# Altium schematic sheet module_wifi.SchDoc
size Tabloid
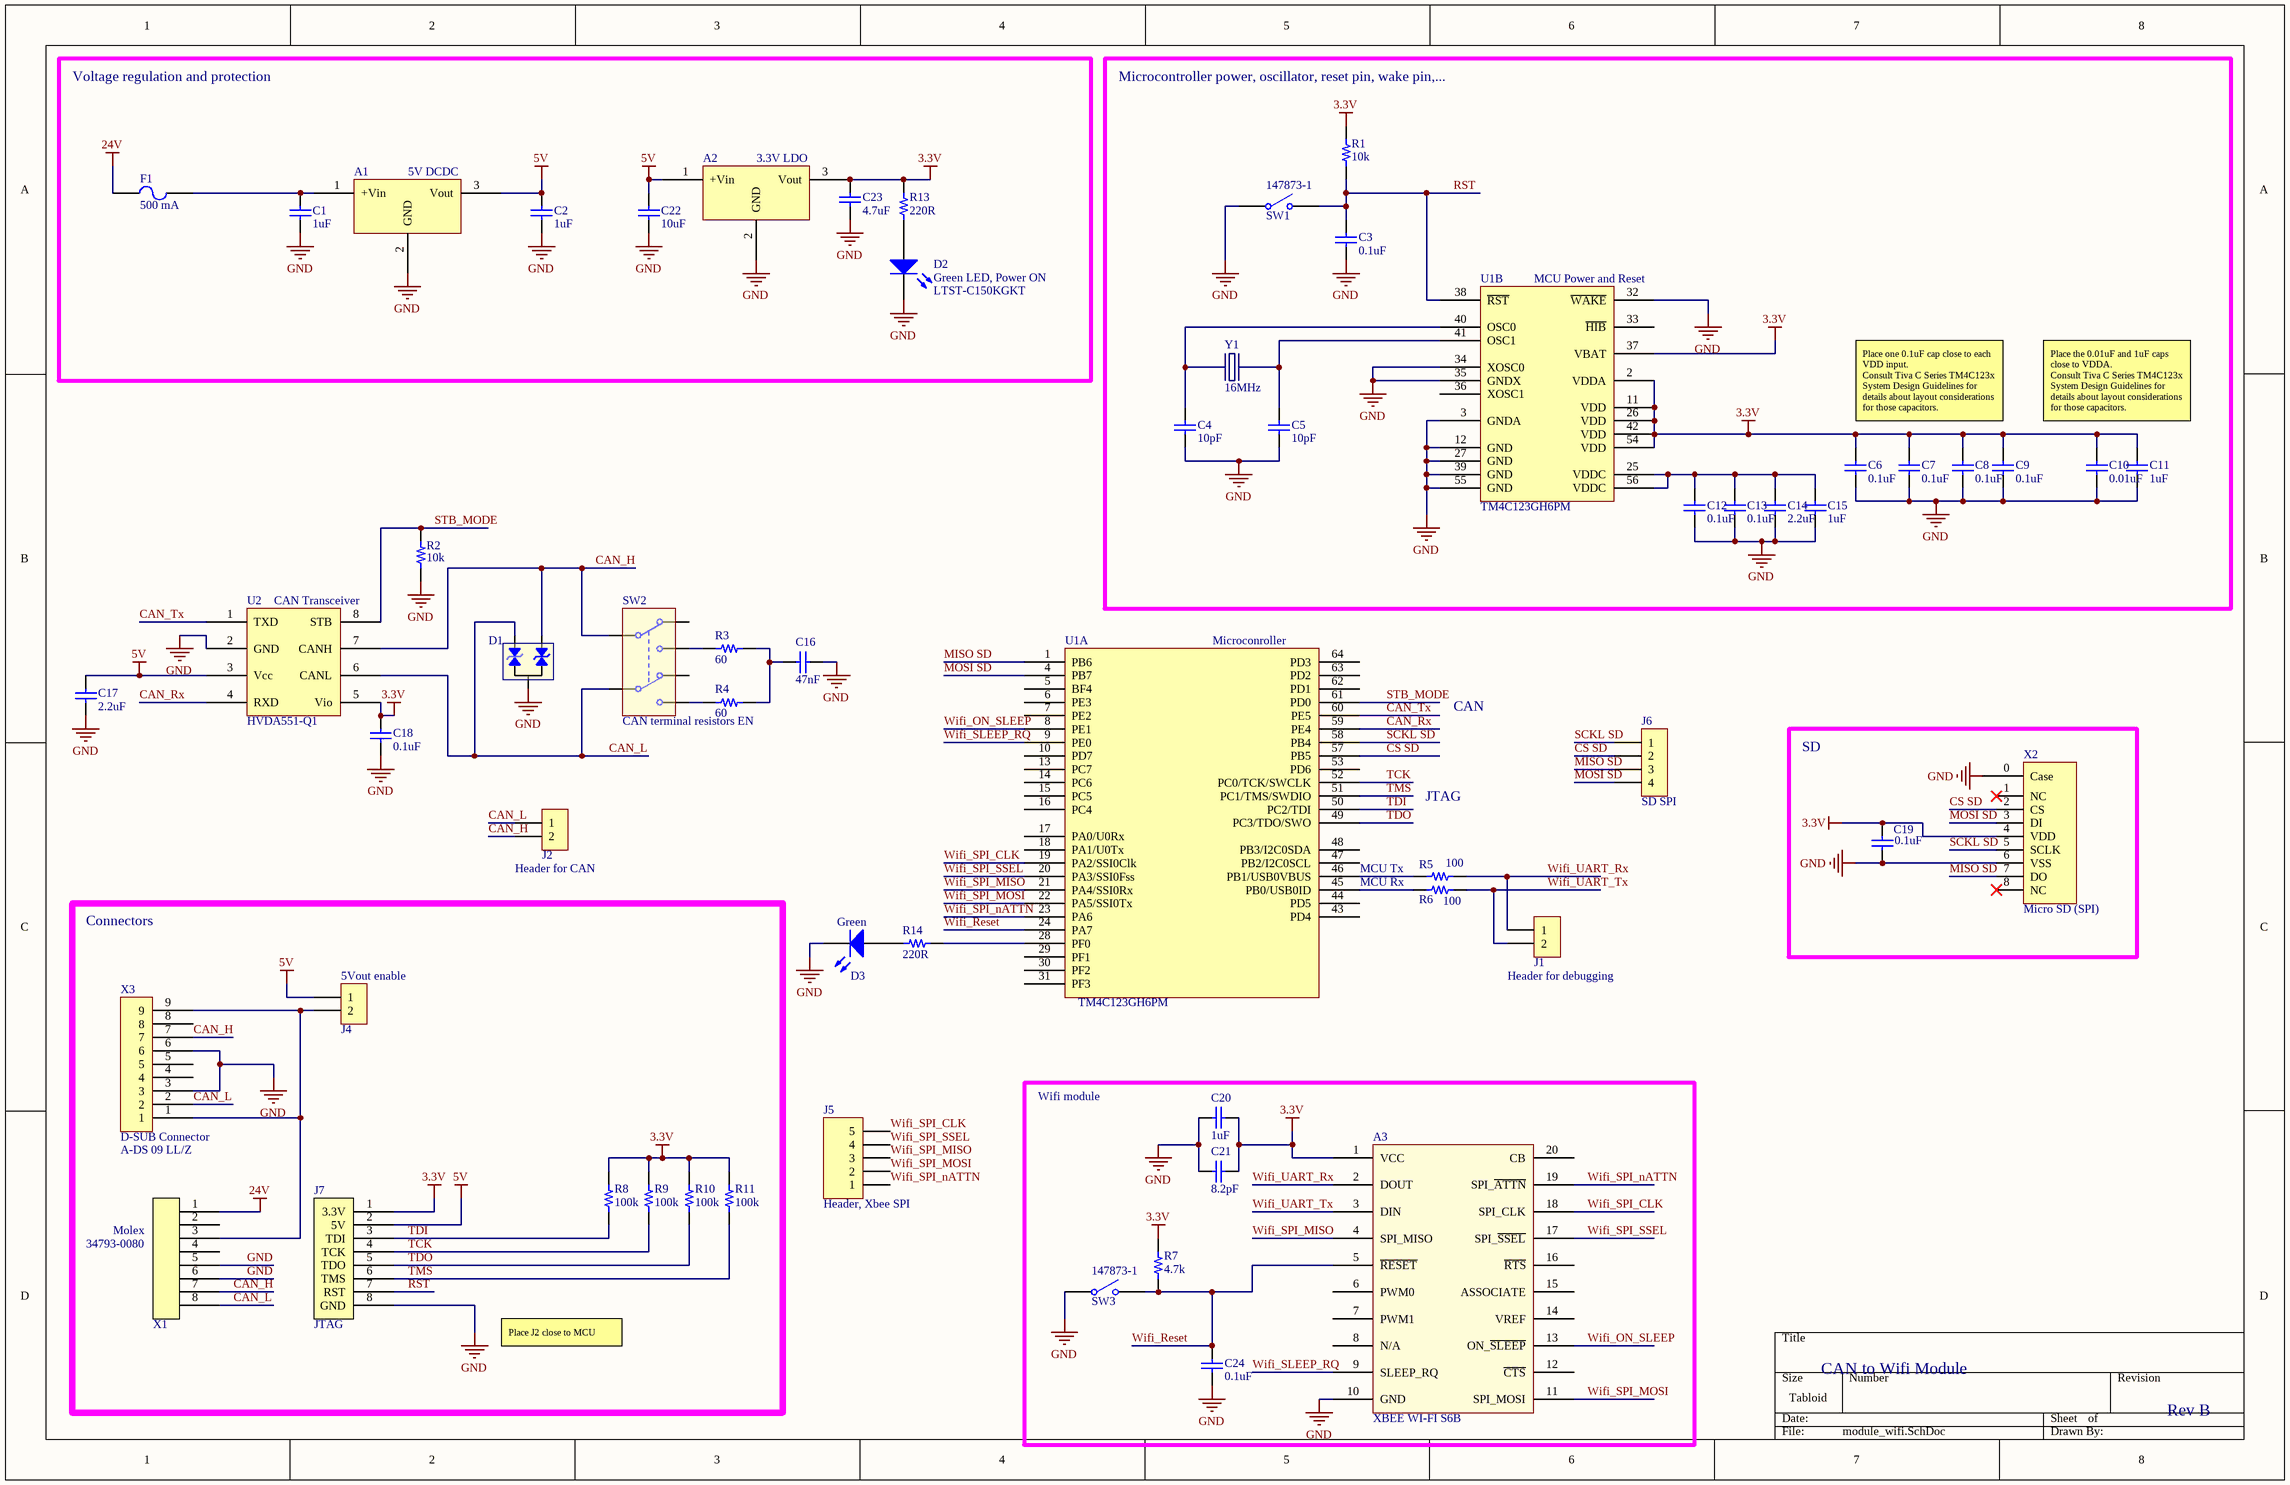
[diagram p0: module_wifi.SchDoc]

## Parts
A1  5V DCDC  [R-78E-0.5]
A2  3.3V LDO  [TO252-3]
A3  XBEE WI-FI S6B  [Xbee_TH]
C1  value 1uF  [C0603]  (hidden comment: CAP CER 0603 1uF 25V X7R 20%)
C2  value 1uF  [C0603]  (hidden comment: CAP CER 0603 1uF 25V X7R 20%)
C3  value 0.1uF  [C0603]  (hidden comment: CAP CER 0603 0.1uF 50V C0G 10%)
C4  value 10pF  [C0603]  (hidden comment: CAP CER 0603 10pF 50V C0G 5%)
C5  value 10pF  [C0603]  (hidden comment: CAP CER 0603 10pF 50V C0G 5%)
C6  value 0.1uF  [C0603]  (hidden comment: CAP CER 0603 0.1uF 50V C0G 10%)
C7  value 0.1uF  [C0603]  (hidden comment: CAP CER 0603 0.1uF 50V C0G 10%)
C8  value 0.1uF  [C0603]  (hidden comment: CAP CER 0603 0.1uF 50V C0G 10%)
C9  value 0.1uF  [C0603]  (hidden comment: CAP CER 0603 0.1uF 50V C0G 10%)
C10  value 0.01uF  [C0603]  (hidden comment: CAP CER 0603 0.01uF 50V X7R 10%)
C11  value 1uF  [C0603]  (hidden comment: CAP CER 0603 1uF 25V X7R 20%)
C12  value 0.1uF  [C0603]  (hidden comment: CAP CER 0603 0.1uF 50V C0G 10%)
C13  value 0.1uF  [C0603]  (hidden comment: CAP CER 0603 0.1uF 50V C0G 10%)
C14  value 2.2uF  [C0603]  (hidden comment: CAP CER 0603 2.2uF 6.3V X7R 10%)
C15  value 1uF  [C0603]  (hidden comment: CAP CER 0603 1uF 25V X7R 20%)
C16  value 47nF  [C0603]  (hidden comment: CAP CER 0603 47nF 50V X7R 10%)
C17  value 2.2uF  [C0603]  (hidden comment: CAP CER 0603 2.2uF 6.3V X7R 10%)
C18  value 0.1uF  [C0603]  (hidden comment: CAP CER 0603 0.1uF 50V C0G 10%)
C19  value 0.1uF  [C0603]  (hidden comment: CAP CER 0603 0.1uF 50V C0G 10%)
C20  value 1uF  [C0603]  (hidden comment: CAP CER 0603 1uF 25V X7R 20%)
C21  value 8.2pF  [C0603]  (hidden comment: CAP CER 0603 8.2pF 50V COG ±0.5pF)
C22  value 10uF  [C0603]  (hidden comment: CAP CER 0603 10uF 6.3V X5R 20%)
C23  value 4.7uF  [C0603]  (hidden comment: CAP CER 0603 4.7uF 25V X7R 10%)
C24  value 0.1uF  [C0603]  (hidden comment: CAP CER 0603 0.1uF 50V C0G 10%)
D1  PESD1CAN-UX  [SOT23]  (value not drawn)
D2  Green LED, Power ON  [LED1206]
D3  Green  [LED1206]
F1  500 mA  [R0603]
J1  Header for debugging  [HDR1X2]
J2  Header for CAN  [HDR1X2]
J4  5Vout enable  [HDR1X2]
J5  Header, Xbee SPI  [HDR1X5]
J6  SD SPI  [HDR1X4]
J7  JTAG  [JTAG_Header]
R1  value 10k  [R0603]  (hidden comment: RES 0603 10k 5% 0.1W)
R2  value 10k  [R0603]  (hidden comment: RES 0603 10k 5% 0.1W)
R3  value 60  [R0603]  (hidden comment: RES 0603 60R 1% 1/4W)
R4  value 60  [R0603]  (hidden comment: RES 0603 60R 1% 1/4W)
R5  value 100  [R0603]  (hidden comment: RES 0603 100R 5% 1/4W)
R6  value 100  [R0603]  (hidden comment: RES 0603 100R 5% 1/4W)
R7  value 4.7k  [R0603]  (hidden comment: RES 0603 4.7k 5% 0.1W)
R8  value 100k  [R0603]  (hidden comment: RES 0603 100k 5% 0.1W)
R9  value 100k  [R0603]  (hidden comment: RES 0603 100k 5% 0.1W)
R10  value 100k  [R0603]  (hidden comment: RES 0603 100k 5% 0.1W)
R11  value 100k  [R0603]  (hidden comment: RES 0603 100k 5% 0.1W)
R13  value 220R  [R0603]  (hidden comment: RES 0603 220R 5% 0.25W)
R14  value 220R  [R0603]  (hidden comment: RES 0603 220R 5% 1/4W)
SW1  147873-1  [147873]
SW2  CAN terminal resistors EN  [CL-SB-22A-01T]
SW3  147873-1  [147873]
U1  Microconroller  Part_Number: TM4C123GH6PM  [LQFP64]  (parts A,B of 2)
U2  CAN Transceiver  [SOIC-8]
X1  Manufacturer: Molex  [34791-0080]  (hidden comment: 34793-0080)
X2  Micro SD (SPI)  [475710001]
X3  D-SUB Connector  [A-DS 09 LL/Z]
Y1  value 16MHz  [NX5032GA]  (hidden comment: NX5043GA-16.00MHz)

## Blocks framed on the sheet
Voltage regulation and protection: A1 A2 C1 C2 C22 C23 D2 F1 R13
Microcontroller power, oscillator, reset pin, wake pin,...: C3-C15 R1 SW1 U1 Y1
SD: C19 X2
Connectors: J4 J7 R8-R11 X1 X3
Wifi module: A3 C20 C21 C24 R7 SW3

## Nets
3.3V: A2.3(Vout) A3.1(VCC) C6.2 C7.2 C8.2 C9.2 C10.2 C11.2 C18.2 C19.2 C20.2 C21.2 C23.2 J7.1(3.3V) R1.2 R7.2 R8.2 R9.2 R10.2 R11.2 R13.2 U1.2(VDDA) U1.11(VDD) U1.26(VDD) U1.37(VBAT) U1.42(VDD) U1.54(VDD) U2.5(Vio) X2.4(VDD)
5V: A1.3(Vout) A2.1(+Vin) C2.2 C17.2 C22.2 J4.1 J7.2(5V) U2.3(Vcc)
24V: F1.2 X1.1
GND: A1.2(GND) A2.2(GND) A3.10(GND) C1.1 C2.1 C3.1 C4.1 C5.1 C6.1 C7.1 C8.1 C9.1 C10.1 C11.1 C12.1 C13.1 C14.1 C15.1 C16.2 C17.1 C18.1 C19.1 C20.1 C21.1 C22.1 C23.1 C24.1 D1.3 D2.2(K) D3.2(K) J7.8(GND) R2.1 SW1.1(COMMON) SW3.1(COMMON) U1.3(GNDA) U1.12(GND) U1.27(GND) U1.32(~{WAKE}) U1.34(XOSC0) U1.35(GNDX) U1.39(GND) U1.55(GND) U2.2(GND) X1.5 X1.6 X2.0(Case) X2.6(VSS) X3.3 X3.6
CAN_H: D1.1 J2.2 SW2.2(COMMON1) U2.7(CANH) X1.7 X3.7
CAN_L: D1.2 J2.1 SW2.5(COMMON2) U2.6(CANL) X1.8 X3.2
CAN_Rx: U1.59(PE4) U2.4(RXD)
CAN_Tx: U1.60(PE5) U2.1(TXD)
CS SD: J6.2 U1.57(PB5) X2.2(CS)
MISO SD: J6.3 U1.1(PB6) X2.7(DO)
MOSI SD: J6.4 U1.4(PB7) X2.3(DI)
RST: C3.2 J7.7(RST) R1.1 SW1.2(NO) U1.38(~{RST})
SCKL SD: J6.1 U1.58(PB4) X2.5(SCLK)
STB_MODE: R2.2 U1.61(PD0) U2.8(STB)
TCK: J7.4(TCK) R9.1 U1.52(PC0/TCK/SWCLK)
TDI: J7.3(TDI) R8.1 U1.50(PC2/TDI)
TDO: J7.5(TDO) R10.1 U1.49(PC3/TDO/SWO)
TMS: J7.6(TMS) R11.1 U1.51(PC1/TMS/SWDIO)
Wifi_ON_SLEEP: A3.13(ON_~{SLEEP}) U1.8(PE1)
Wifi_Reset: A3.5(~{RESET}) C24.2 R7.1 SW3.2(NO) U1.24(PA7)
Wifi_SLEEP_RQ: A3.9(SLEEP_RQ) U1.9(PE0)
Wifi_SPI_CLK: A3.18(SPI_CLK) J5.5 U1.19(PA2/SSI0Clk)
Wifi_SPI_MISO: A3.4(SPI_MISO) J5.3 U1.21(PA4/SSI0Rx)
Wifi_SPI_MOSI: A3.11(SPI_MOSI) J5.2 U1.22(PA5/SSI0Tx)
Wifi_SPI_nATTN: A3.19(SPI_~{ATTN}) J5.1 U1.23(PA6)
Wifi_SPI_SSEL: A3.17(SPI_~{SSEL}) J5.4 U1.20(PA3/SSI0Fss)
Wifi_UART_Rx: A3.2(DOUT) J1.1 R5.1
Wifi_UART_Tx: A3.3(DIN) J1.2 R6.1
NetA1_1: A1.1(+Vin) C1.2 F1.1
NetC4_2: C4.2 U1.40(OSC0) Y1.1
NetC5_2: C5.2 U1.41(OSC1) Y1.2
NetC12_2: C12.2 C13.2 C14.2 C15.2 U1.25(VDDC) U1.56(VDDC)
NetC16_1: C16.1 R3.1 R4.1
NetD2_1: D2.1(A) R13.1
NetD3_1: D3.1(A) R14.1
NetJ4_2: J4.2 X1.3 X3.1 X3.9
NetR3_2: R3.2 SW2.3(NO1)
NetR4_2: R4.2 SW2.6(NO2)
NetR5_2: R5.2 U1.46(PB1/USB0VBUS)
NetR6_2: R6.2 U1.45(PB0/USB0ID)
NetR14_2: R14.2 U1.28(PF0)

Not connected (* = marked no-connect by the designer): A3 6(PWM0) 7(PWM1) 8(N/A) 12(~{CTS}) 14(VREF) 15(ASSOCIATE) 16(~{RTS}) 20(CB); SW2 1(NC1) 4(NC2); U1 5(BF4) 6(PE3) 7(PE2) 10(PD7) 13(PC7) 14(PC6) 15(PC5) 16(PC4) 17(PA0/U0Rx) 18(PA1/U0Tx) 29(PF1) 30(PF2) 31(PF3) 33(~{HIB}) 36(XOSC1) 43(PD4) 44(PD5) 47(PB2/I2C0SCL) 48(PB3/I2C0SDA) 53(PD6) 62(PD1) 63(PD2) 64(PD3); X1 2 4; X2 1(NC)* 8(NC)*; X3 4 5 8

## Notes on the sheet
- Place one 0.1uF cap close to each VDD input.
  Consult Tiva C Series TM4C123x System Design Guidelines for details about layout considerations for those capacitors.
- Place the 0.01uF and 1uF caps close to VDDA.
  Consult Tiva C Series TM4C123x System Design Guidelines for details about layout considerations for those capacitors.
- CAN
- JTAG
- MCU Rx
- MCU Tx
- Place J2 close to MCU
- CAN to Wifi Module
- Rev B

## Library data of the parts
A1 = R78E5.0-0.5: Manufacturer: Recom; Part_Number: R-78E5.0-0.5; Vin: 7-28V; Iout: 500mA; Efficiency: 82-92%; Supplier_Link: http://www.digikey.ca/product-detail/en/R-78E5.0-0.5/945-1648-5-ND/2834904; Vout: 5V; Price: 4.04; Price_10: 3.972
A2 = NCV5501DT33RKG: Linear Voltage Regulator IC Positive Fixed 1 Output 3.3V 500mA DPAK-3; Manufacturer: ON Semiconductor; Iout: 500 mA; Price: 1.33; Price_10: 1.194; Supplier 1: Digi-Key; Supplier_Link: http://www.digikey.ca/product-detail/en/on-semiconductor/NCV5501DT33RKG/NCV5501DT33RKGOSCT-ND/3462418; Supplier Part Number 1: NCV5501DT33RKGOSCT-ND; Vout: 3.3V; Part_Number: NCV5501DT33RKG
A3 = XBEE WI-FI S6B: Module Wifi; Manufacturer: Digi International; Part_Number: XB2B-WFST-001; Price: 36.19; Supplier 1: Digi-Key; Supplier_Link: http://www.digikey.com/product-search/en?mpart=XB2B-WFST-001&vendor=602; Supplier Part Number 1: 602-1380-ND
C1 C2 C11 C15 C20 = CAP CER 0603 1uF 25V X7R 20%: 1uF ceramic capacitor; Manufacturer: TDK Corporation; Part_Number: CGA3E1X7R1E105M080AC; Supplier_Link: http://www.digikey.ca/product-detail/en/CGA3E1X7R1E105M080AC/445-12548-1-ND/3954214; Tolerance: 20%; Voltage rating: 25V; Price: 0.24; Price_10: 0.171
  C20: Supplier 1: Digi-Key; Supplier Part Number 1: 445-12548-1-ND
C3 C6-C9 C12 C13 C18 C19 C24 = CAP CER 0603 0.1uF 50V C0G 10%: 0.1uF ceramic capacitor; Manufacturer: TDK Corporation; Part_Number: CGA3E2X7R1H104K080AA; Supplier_Link: http://www.digikey.ca/product-detail/en/CGA3E2X7R1H104K080AA/445-5666-1-ND/2443706; Tolerance: 10%; Voltage rating: 50V; Price: 0.14; Price_10: 0.102
  C19: Supplier 1: Digi-Key; Supplier Part Number 1: 445-5666-1-ND
C4 C5 = CAP CER 0603 10pF 50V C0G 5%: 10pF ceramic capacitor; Manufacturer: TDK Corporation; Part_Number: CGA3E2C0G1H100D080AA; Supplier_Link: http://www.digikey.ca/product-detail/en/CGA3E2C0G1H100D080AA/445-5628-1-ND/2443668; Tolerance: 5%; Voltage rating: 50V; Price: 0.14; Price_10: 0.077
C10 = CAP CER 0603 0.01uF 50V X7R 10%: 0.01uF ceramic capacitor; Manufacturer: TDK Corporation; Part_Number: CGA3E2X7R1H103K080AA; Supplier_Link: http://www.digikey.ca/product-detail/en/CGA3E2X7R1H103K080AA/445-5662-1-ND/2443702; Tolerance: 10%; Voltage rating: 50V; Price: 0.14; Price_10: 0.102
C14 C17 = CAP CER 0603 2.2uF 6.3V X7R 10%: 2.2uF ceramic capacitor; Manufacturer: TDK Corporation; Part_Number: CGA3E1X7R0J225K080AC; Supplier_Link: http://www.digikey.ca/product-detail/en/CGA3E1X7R0J225K080AC/445-6933-1-ND/2672951; Tolerance: 10%; Voltage rating: 6.3V; Price: 0.34; Price_10: 0.235
C16 = CAP CER 0603 47nF 50V X7R 10%: 47nF ceramic capacitor; Manufacturer: TDK Corporation; Part_Number: CGA3E2X7R1H473K080AA; Supplier_Link: http://www.digikey.ca/product-detail/en/CGA3E2X7R1H473K080AA/445-5664-1-ND/2443704; Tolerance: 10%; Voltage rating: 50V; Price: 0.14; Price_10: 0.102
C21 = CAP CER 0603 8.2pF 50V COG ±0.5pF: 8.2pF 50V Ceramic Capacitor C0G, NP0 0603; Manufacturer: Murata-Electronics-North-America; Part_Number: GCM1885C1H8R2DA16D; Price: 0.15; Price_10: 0.111; Supplier 1: Digi-Key; Supplier_Link: http://www.digikey.ca/product-detail/en/murata-electronics-north-america/GCM1885C1H8R2DA16D/490-11155-1-ND/5332995; Supplier Part Number 1: 490-11155-1-ND; Tolerance: ±0.5pF; Voltage rating: 50V
C22 = CAP CER 0603 10uF 6.3V X5R 20%: 10uF ceramic capacitor; Manufacturer: Taiyo Yuden; Part_Number: JMK107ABJ106MAHT; Supplier_Link: http://www.digikey.ca/product-detail/en/JMK107ABJ106MAHT/587-3383-1-ND/4157249; Tolerance: 20%; Voltage rating: 6.3V; Price: 0.30; Supplier 1: Digi-Key; Supplier Part Number 1: 587-3383-1-ND; Price_10: 0.205
C23 = CAP CER 0603 4.7uF 25V X7R 10%: 4.7uF ceramic capacitor; Manufacturer: Kernet; Part_Number: C1206C475K3RACAUTO; Supplier_Link: http://www.digikey.ca/product-detail/en/CGA3E3X7R1E474K080AB/445-6929-1-ND/2672947; Tolerance: 10%; Voltage rating: 25V; Price: 0.48; Supplier 1: Digi-Key; Supplier Part Number 1: 399-7029-1-ND; Price_10: 0.428
D1 = PESD1CAN-UX: TVS diodes for CAN bus; Manufacturer: NXP; Part_Number: PESD1CAN-UX; Price: 0.51; Price_10: 0.419; Supplier_Link: http://www.digikey.ca/product-detail/en/nxp-semiconductors/PESD1CAN-UX/568-10731-1-ND/4386316
D2 D3 = LTST-C150KGKT: Green LED 1206; Manufacturer: Liteon; Supplier_Link: http://www.digikey.ca/product-detail/en/LTST-C150KGKT/160-1404-1-ND/386759; Price: 0.55; Price_10: 0.40; Part_Number: LTST-C150KGKT
F1 = C2Q500: Fuse, 500 mA, 63VDC, 0603, fast; Part_Number: C2Q 500; Manufacturer: Bel Fuse; Supplier_Link: http://www.digikey.ca/product-detail/en/bel-fuse-inc/C2Q-500/507-1089-1-ND/615037; Price: 0.45; Current rating: 500 mA
J1 J2 J4 = Header 2: Header, 2-Pin
J5 = Header 5: Header, 5-Pin
J6 = Header 4: Header, 4-Pin
J7 = JTAG_Header: JTAG header, MCU programming
R1 R2 = RES 0603 10k 5% 0.1W: 10 kOhms resistor; Part_Number: CRCW060310K0JNEA; Manufacturer: Vishay; Price: 0.15; Supplier_Link: http://www.digikey.ca/product-detail/en/CRCW060310K0JNEA/541-10KGCT-ND/1179393; Price_10: 0.033
R3 R4 = RES 0603 60R 1% 1/4W: 60 Ohms resistor, 1/4W; Part_Number: ESR03EZPJ620; Manufacturer: Rohm Semiconductor; Price: 0.15; Supplier_Link: http://www.digikey.ca/product-detail/en/ESR03EZPJ620/RHM62DCT-ND/1983794; Price_10: 0.12
R5 R6 = RES 0603 100R 5% 1/4W: 100 Ohms resistor, 1/4W; Part_Number: ESR03EZPJ101; Manufacturer: Rohm Semiconductor; Price: 0.15; Supplier_Link: http://www.digikey.ca/product-detail/en/ESR03EZPJ101/RHM100DCT-ND/1983776; Price_10: 0.12
R7 = RES 0603 4.7k 5% 0.1W: 4.7 kOhms resistor; Part_Number: CRCW06034K70JNEA; Manufacturer: Vishay; Price: 0.15; Supplier_Link: http://www.digikey.ca/product-detail/en/CRCW06034K70JNEA/541-4.7KGCT-ND/1179385; Price_10: 0.033
R8-R11 = RES 0603 100k 5% 0.1W: 100 kOhm resistor; Part_Number: CRCW0603100KJNEA; Manufacturer: Vishay; Price: 0.15; Supplier_Link: http://www.digikey.ca/product-detail/en/CRCW0603100KJNEA/541-100KGCT-ND/1179417; Price_10: 0.033
R13 = RES 0603 220R 5% 0.25W: 220 Ohms 0.25W Resistor; Part_Number: ESR03EZPJ221; Manufacturer: Rohm Semiconductor; Price: 0.15; Supplier_Link: http://www.digikey.ca/product-detail/en/ESR03EZPJ221/RHM220DCT-ND/1983788; Power: 0.25W; Supplier 1: Digi-Key; Supplier Part Number 1: RHM220DCT-ND; Tolerance: 5%; Price_10: 0.12
R14 = RES 0603 220R 5% 1/4W: 220 Ohms resistor, 1/4W; Part_Number: ESR03EZPJ221; Manufacturer: Rohm Semiconductor; Price: 0.15; Supplier_Link: http://www.digikey.ca/product-detail/en/ESR03EZPJ221/RHM220DCT-ND/1983788; Price_10: 0.12
SW1 SW3 = 147873-1: Pushbutton switch SPST, 2 pins; Manufacturer: TE Connectivity; Price: 0.30; Part_Number: 147873-1
  SW1: Supplier_Link: http://ca.mouser.com/ProductDetail/TE-Connectivity-Alcoswitch/147873-1/?qs=sGAEpiMZZMvxtGF7dlGNpsxRhg8g8FqHC2R98arEfD8%3d
  SW3: Supplier_Link: http://www.te.com/usa-en/product-147873-1.html
SW2 = CL-SB-22A-01T: SWITCH SLIDE DPDT 200MA 12VDC; Manufacturer: Copal Electronics Inc.; Supplier_Link: http://www.digikey.ca/product-detail/en/copal-electronics-inc/CL-SB-22A-01T/563-1338-1-ND/3507893; Price: 1.4; Price_10: 1.347; Supplier 1: Digi-Key; Supplier Part Number 1: 563-1338-1-ND; Part_Number: CL-SB-22A-01T
U1 = TM4C123GN6PM: 32 bit Microcontroller; Manufacturer: Texas Instrument; Price: 8.50; Supplier_Link: http://www.ti.com/product/TM4C123GH6PM/samplebuy
U2 = HVDA551-Q1: Automotive 5-V CAN Transceiver with I/O Level Adapting and Low-Power Mode Supply Optimization; Manufacturer: Texas Instrument; Supplier_Link: http://www.ti.com/product/HVDA551-Q1/samplebuy; Supplier 1: Digi-Key; Supplier Part Number 1: 296-40116-1-ND; Type: CAN Transceiver; Part_Number: HVDA551-Q1
X1 = 34793-0080: Molex Mini50, 8 position, single row, right angle; Part_Number: 34793-0080; Supplier_Link: http://www.digikey.ca/product-search/en?vendor=0&keywords=34793-0080; Price: 2.13
X2 = 475710001: microSD connector, Surface Mount, Right Angle; Manufacturer: Molex; Part_Number: 47571-0001; Price: 1.39; Price_10: 1.227; Supplier_Link: http://www.digikey.ca/product-search/en/connectors-interconnects/memory-connectors-pc-card-sockets/1442985?k=475710001&k=&pkeyword=475710001&pv7=2&FV=fff40016%2Cfff804a9&mnonly=0&newproducts=0&ColumnSort=0&page=1&stock=1&quantity=0&ptm=0&fid=0&pageSize=25
X3 = A-DS 09 LL/Z: CONN D-SUB PLUG 9POS R/A SOLDER; Manufacturer: Assmann WSW Components; Positions: 9; Supplier_Link: http://www.digikey.ca/product-detail/en/assmann-wsw-components/A-DS-09-LL-Z/AE10972-ND/1241781; Price: 0.72; Mounting Type: Board Edge; Part_Number: A-DS 09 LL/Z; Price_10: 0.682
Y1 = NX5043GA-16.00MHz: Crystal Oscillator 16 MHz; Manufacturer: NDK; Part_Number: NX5032GA-16.000M-LN-CD-1; ESR: 120 Ohms; Supplier_Link: http://www.digikey.ca/product-detail/en/NX5032GA-16.000000MHZ-LN-CD-1/644-1037-1-ND/1128909; Price: 0.95; Price_10: 0.796